# EAGLE schematic board (EAGLE 7.4.0)
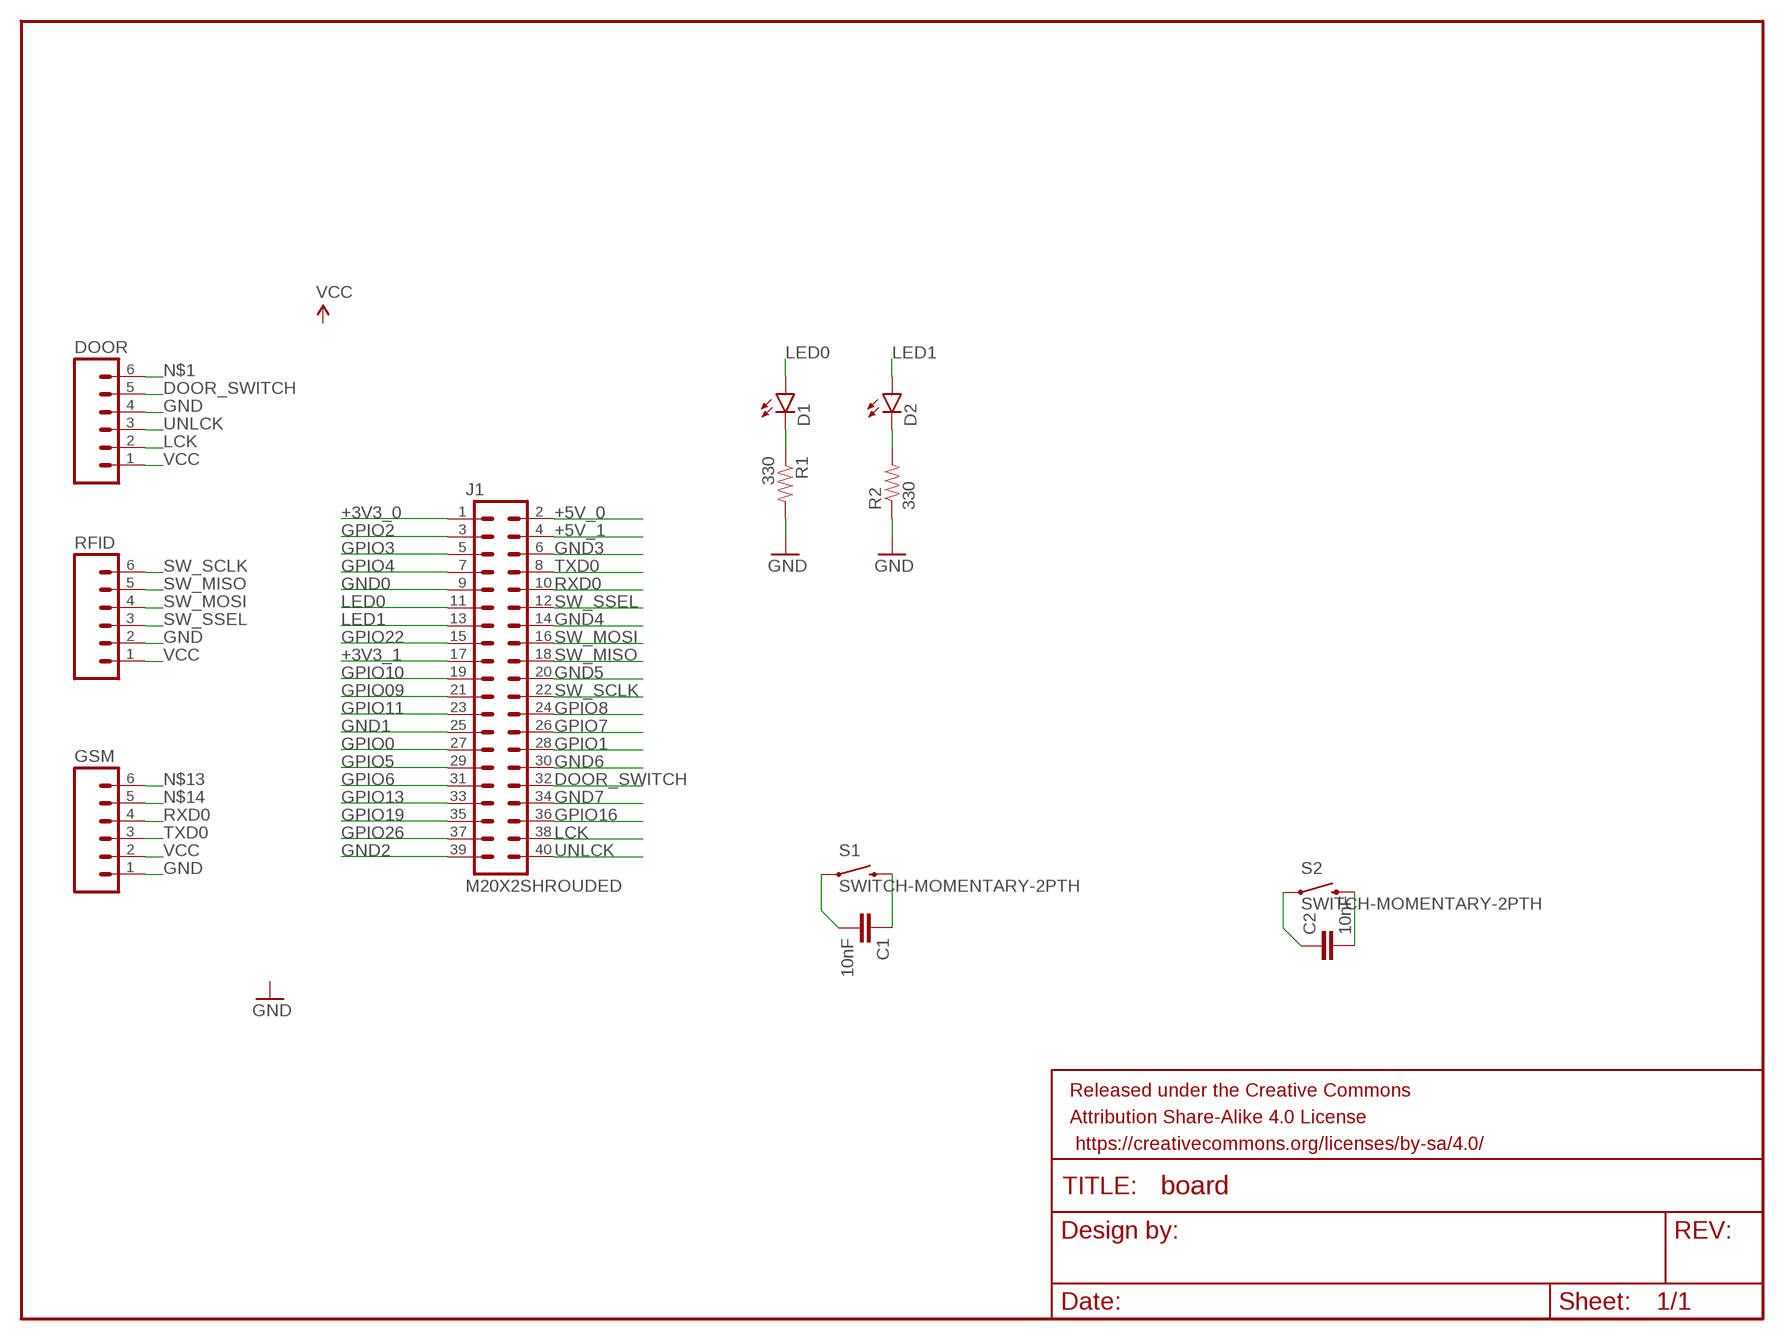
[diagram p0: schematic, sheet 1]

## Parts
C1  10nF  CAPPTH  [CAP-PTH-SMALL]
C2  10nF  CAPPTH  [CAP-PTH-SMALL]
D1  LED5MM  [LED5MM]
D2  LED5MM  [LED5MM]
DOOR  M06LOCK  [1X06_LOCK]
FRAME1  FRAME-LETTER  [CREATIVE_COMMONS]
GSM  M06LOCK  [1X06_LOCK]
J1  M20X2SHROUDED  [2X20_SHROUDED]
R1  330  RESISTORPTH-1/4W  [AXIAL-0.4]
R2  330  RESISTORPTH-1/4W  [AXIAL-0.4]
RFID  M06LOCK  [1X06_LOCK]
S1  SWITCH-MOMENTARY-2PTH  [TACTILE-PTH]
S2  SWITCH-MOMENTARY-2PTH  [TACTILE-PTH]

## Nets
+3V3_0: J1.1
+3V3_1: J1.17
+5V_0: J1.2
+5V_1: J1.4
DOOR_SWITCH: DOOR.5 J1.32
GND: DOOR.4 GSM.1 R1.P$2 R2.P$1 RFID.2
GND0: J1.9
GND1: J1.25
GND2: J1.39
GND3: J1.6
GND4: J1.14
GND5: J1.20
GND6: J1.30
GND7: J1.34
GPIO1: J1.28
GPIO2: J1.3
GPIO3: J1.5
GPIO4: J1.7
GPIO5: J1.29
GPIO6: J1.31
GPIO7: J1.26
GPIO8: J1.24
GPIO09: J1.21
GPIO10: J1.19
GPIO11: J1.23
GPIO13: J1.33
GPIO16: J1.36
GPIO19: J1.35
GPIO22: J1.15
GPIO26: J1.37
LCK: DOOR.2 J1.38
LED0: D1.A J1.11
LED1: D2.A J1.13
N$1: DOOR.6
N$2: D1.K(C) R1.P$1
N$3: D2.K(C) R2.P$2
N$13: GSM.6
N$14: GSM.5
N$19: C1.2 S1.1
N$20: C1.1 S1.3
N$21: C2.1 S2.1
N$22: C2.2 S2.3
RXD0: GSM.4 J1.10
SW_MISO: J1.18 RFID.5
SW_MOSI: J1.16 RFID.4
SW_SCLK: J1.22 RFID.6
SW_SSEL: J1.12 RFID.3
TXD0: GSM.3 J1.8
UNLCK: DOOR.3 J1.40
VCC: DOOR.1 GSM.2 RFID.1
Unconnected: J1.27

## Library data of the parts
C1 C2 = SparkFun-Passives:CAP: Capacitor Standard 0603 ceramic capacitor, and 0.1" leaded capacitor.
D1 D2 = SparkFun-LED:LED: LEDs Standard schematic elements and footprints for 5mm, 3mm, 1206, and 0603 sized LEDs. 5mm - Spark Fun Electronics SKU : COM-00529 (and others)
DOOR GSM RFID = SparkFun-Connectors:M06: Header 6 Standard 6-pin 0.1" header. Use with straight break away headers (SKU : PRT-00116), right angle break away headers (PRT-00553), swiss pins (PRT-00743), machine pins (PRT-00117), and female headers (PRT-00115). Molex polarized connector foot print use with SKU : PRT-08094 with associated crimp pins and housings. NOTES ON THE VARIANTS LOCK and LOCK_LONGPADS... This footprint was designed to help hold the alignment of a through-hole component (i.e. 6-pin header) while soldering it into place. You may notice that each hole has been shifted either up or down by 0.005 of an inch from it's more standard position (which is a perfectly straight line). This slight alteration caused the pins (the squares in the middle) to touch the edges of the holes. Because they are alternating, it causes a "brace" to hold the component in place. 0.005 has proven to be the perfect amount of "off-center" position when using our standard breakaway headers. Although looks a little odd when you look at the bare footprint, once you have a header in there, the alteration is very hard to notice. Also,if you push a header all the way into place, it is covered up entirely on the bottom side. This idea of altering the position of holes to aid alignment will be further integrated into the Sparkfun Library for other footprints. It can help hold any component with 3 or more connection pins.
FRAME1 = SparkFun-Aesthetics:FRAME-LETTER: Schematic Frame Standard 8.5x11 US Letter frame
J1 = SparkFun-Connectors:M20X2: 0.1" spaced headers; PROD_ID: CONN-12263
R1 R2 = SparkFun-Passives:RESISTOR: Resistor Basic schematic elements and footprints for 0603, 1206, and PTH resistors.
S1 S2 = SparkFun-Electromechanical:SWITCH-MOMENTARY-2: Various NO switches- pushbuttons, reed, etc; PROD_ID: SWCH-08441